# EAGLE design sonar_hotfix_2 (EAGLE 9.0.0)
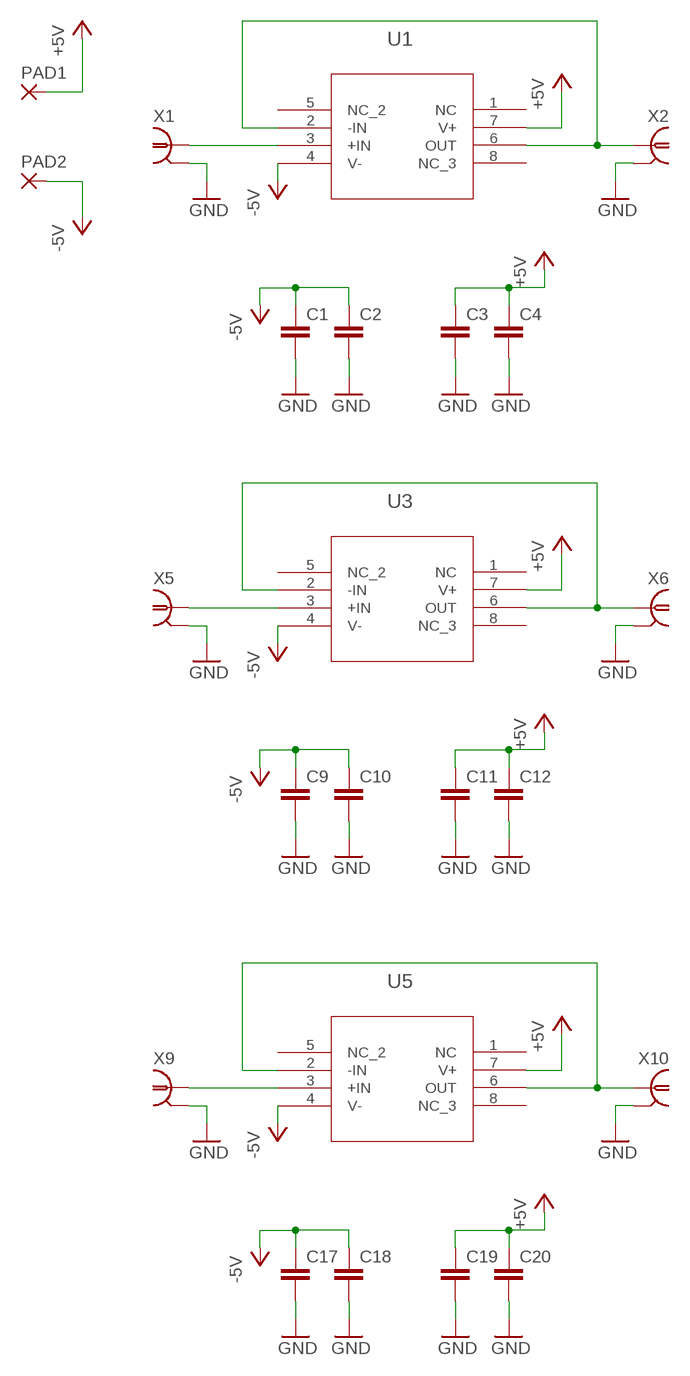
[diagram p0: schematic, sheet 1]

## Parts
C1  C-EUC0603  [C0603]
C2  C-EUC0603  [C0603]
C3  C-EUC0603  [C0603]
C4  C-EUC0603  [C0603]
C9  C-EUC0603  [C0603]
C10  C-EUC0603  [C0603]
C11  C-EUC0603  [C0603]
C12  C-EUC0603  [C0603]
C17  C-EUC0603  [C0603]
C18  C-EUC0603  [C0603]
C19  C-EUC0603  [C0603]
C20  C-EUC0603  [C0603]
PAD1  WIREPADSMD5-2,5  [5-2,5]
PAD2  WIREPADSMD5-2,5  [5-2,5]
U1  LTC6240SO-8  [SO-8]
U3  LTC6240SO-8  [SO-8]
U5  LTC6240SO-8  [SO-8]
X1  0731000105  [0731000105]
X2  0731000105  [0731000105]
X5  0731000105  [0731000105]
X6  0731000105  [0731000105]
X9  0731000105  [0731000105]
X10  0731000105  [0731000105]

## Nets
+5V: C3.1 C4.1 C11.1 C12.1 C19.1 C20.1 PAD1.1(P) U1.7(V+) U3.7(V+) U5.7(V+)
-5V: C1.1 C2.1 C9.1 C10.1 C17.1 C18.1 PAD2.1(P) U1.4(V-) U3.4(V-) U5.4(V-)
GND: C1.2 C2.2 C3.2 C4.2 C9.2 C10.2 C11.2 C12.2 C17.2 C18.2 C19.2 C20.2 X1.P$1 X1.P$2 X2.P$1 X2.P$2 X5.P$1 X5.P$2 X6.P$1 X6.P$2 X9.P$1 X9.P$2 X10.P$1 X10.P$2
N$1: U1.3(+IN) X1.P$3
N$2: U1.2(-IN) U1.6(OUT) X2.P$3
N$5: U3.3(+IN) X5.P$3
N$6: U3.2(-IN) U3.6(OUT) X6.P$3
N$9: U5.3(+IN) X9.P$3
N$10: U5.2(-IN) U5.6(OUT) X10.P$3
Unconnected: U1.1(NC) U1.5(NC_2) U1.8(NC_3) U3.1(NC) U3.5(NC_2) U3.8(NC_3) U5.1(NC) U5.5(NC_2) U5.8(NC_3)

## Library data of the parts
C1-C4 C9-C12 C17-C20 = rcl:C-EU: CAPACITOR, European symbol; SPICEPREFIX: C
PAD1 PAD2 = wirepad:WIREPAD: Wire PAD connect wire on PCB
U1 U3 U5 = hotfix:LTC6240
X1 X2 X5 X6 X9 X10 = hotfix:0731000105

## Board
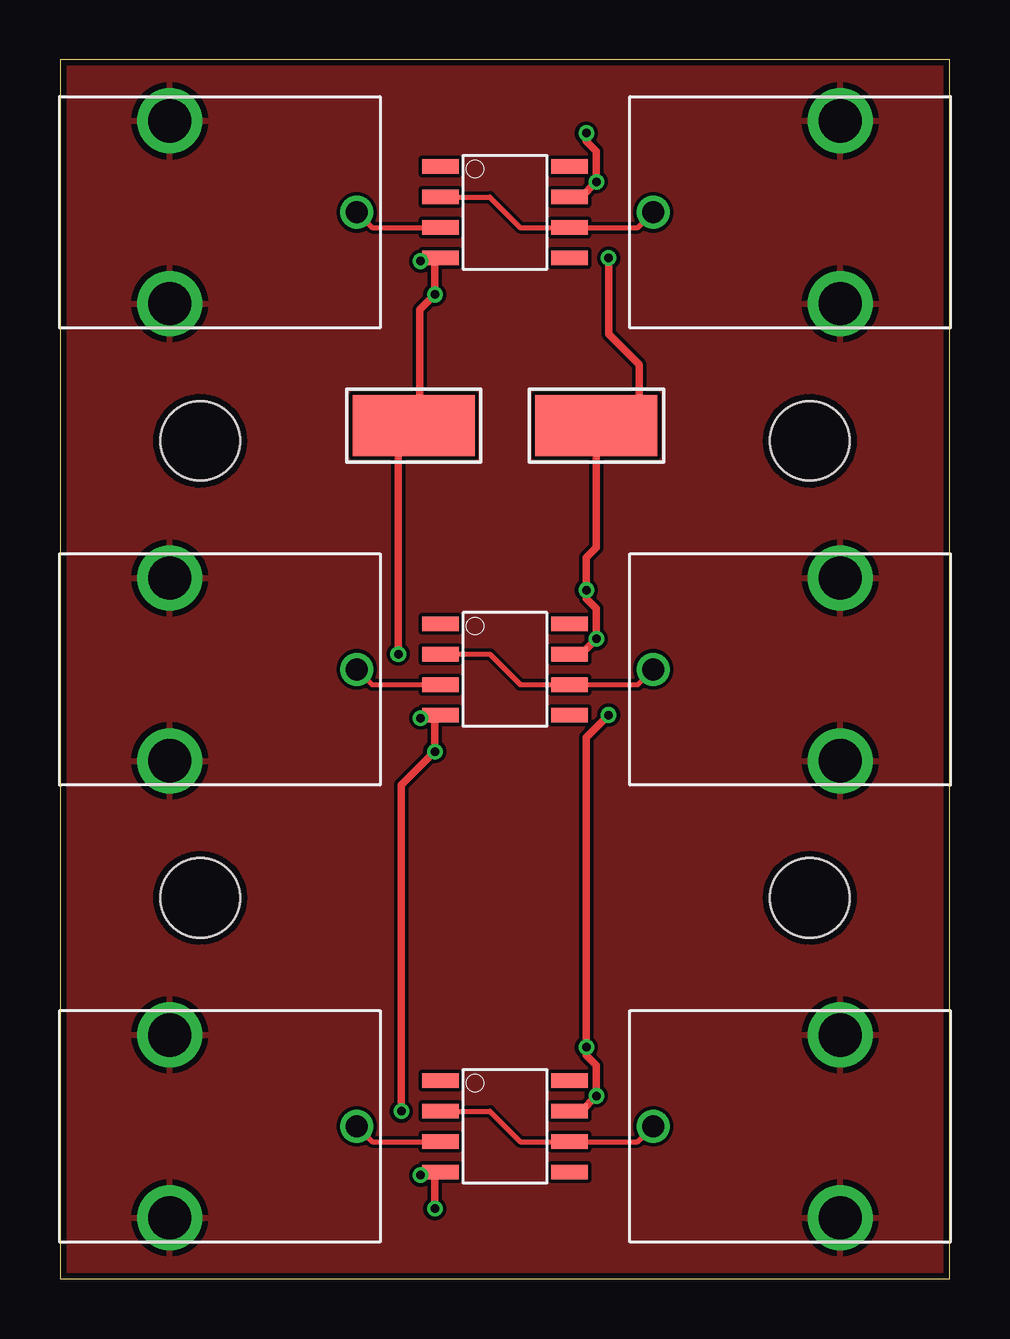
[diagram p1: board, top side]
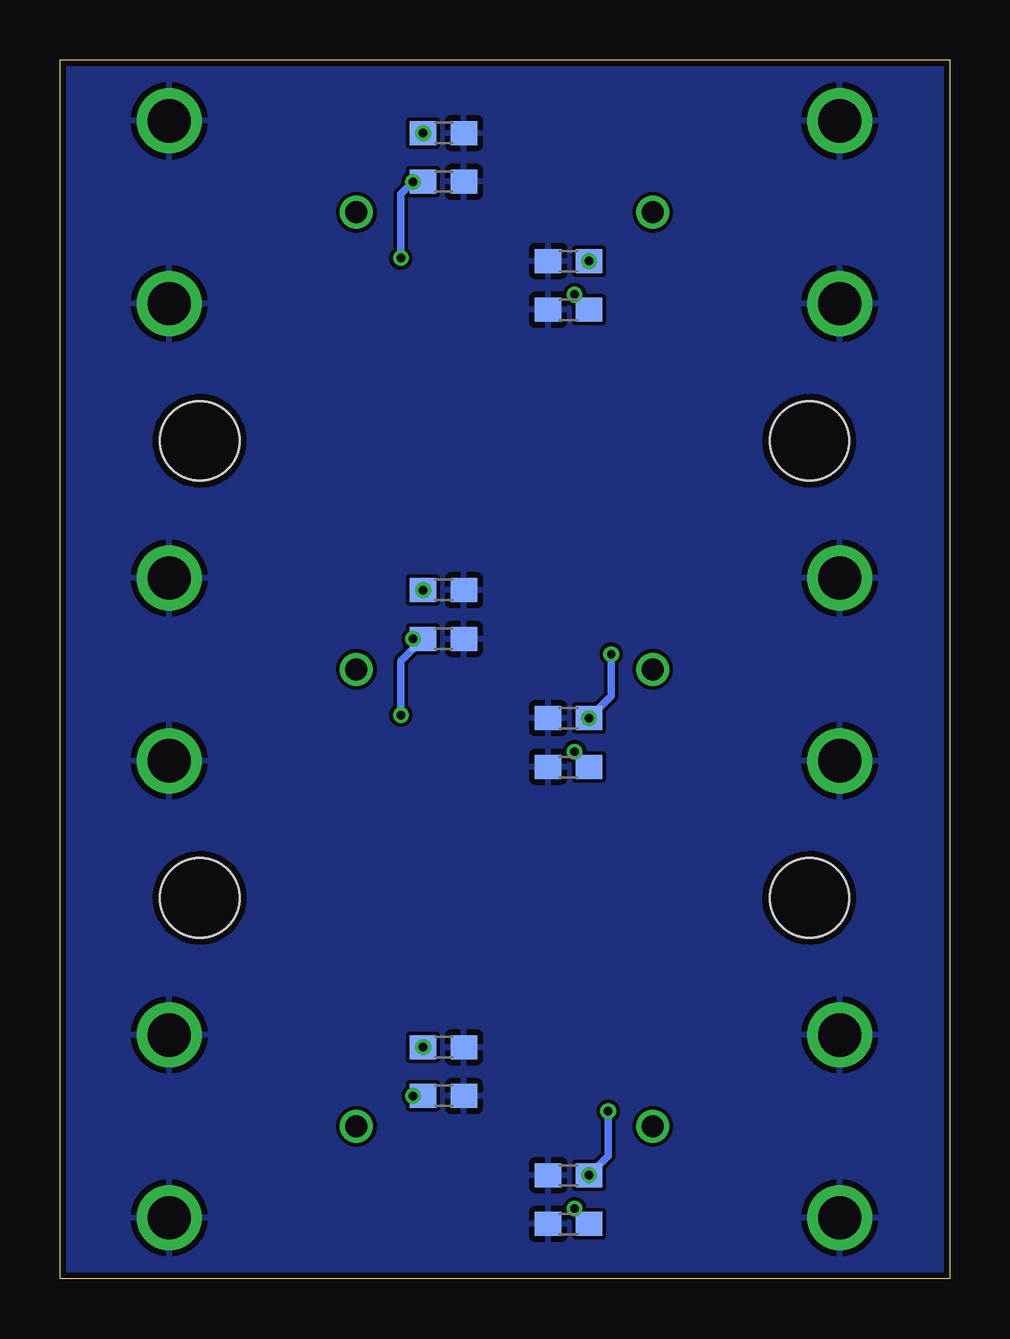
[diagram p2: board, bottom side, seen from below]

Size 37.06 x 50.8 mm. Coordinates in mm from the lower left corner, seen from the top.
Outline: 37.06,50.8 0,50.8 0,0 37.06,0 37.06,50.8
Copper layers (1*16): Top 0.035mm / dielectric 1.5mm / Bottom 0.035mm
Design rules "JLCPCB2Layer": minimum track width 6mil, minimum drill 10mil, track to track 6mil, track to pad 6mil, pad to pad 6mil, via to via 6mil, smd to smd 0mil, copper to edge 10mil, drill to drill 10mil, minimum pad ring 6mil, minimum via ring 6mil, stop-mask expansion 2mil, vias tented up to drill 100mil, thermal gap 10mil

### Footprints (pad centres in the part's own frame; a part is rotated, then mirrored left to right if it is on the bottom)
C0603 = smd 1.1 x 1: 1 -0.85,0; 2 0.85,0
5-2,5 = smd 2.54 x 5.08: 1 0,0
SO-8 = smd 1.524 x 0.61: 1 -2.692,1.905; 2 -2.692,0.635; 3 -2.692,-0.635; 4 -2.692,-1.905; 5 2.692,-1.905; 6 2.692,-0.635; 7 2.692,0.635; 8 2.692,1.905
STAND-OFF = hole 3.302: 0,0
0731000105 = drill 1.803: P$1 3.81,0; P$2 -3.81,0 | drill 0.914: P$3 0,7.798

### Placement (x,y rotation side)
C1  15.88,40.39 180 bottom
C2  15.88,42.42 180 bottom
C3  21.08,45.72 0 bottom
C4  21.08,47.75 0 bottom
C9  15.88,21.34 180 bottom
C10  15.88,23.37 180 bottom
C11  21.08,26.67 0 bottom
C12  21.08,28.7 0 bottom
C17  15.88,2.29 180 bottom
C18  15.88,4.32 180 bottom
C19  21.08,7.62 0 bottom
C20  21.08,9.65 0 bottom
PAD1  22.35,35.56 270 top
PAD2  14.73,35.56 90 top
U1  18.54,44.45 0 top
U3  18.54,25.4 0 top
U5  18.54,6.35 0 top
U$1  [STAND-OFF]  31.24,34.92 0 top
U$2  [STAND-OFF]  5.84,34.92 0 top
U$3  [STAND-OFF]  5.84,15.88 0 top
U$4  [STAND-OFF]  31.24,15.88 0 top
X1  4.57,44.45 270 top
X2  32.51,44.45 90 top
X5  4.57,25.4 270 top
X6  32.51,25.4 90 top
X9  4.57,6.35 270 top
X10  32.51,6.35 90 top

### Tracks (layer width: path | path; a pad name or v marks a point on that pad's centre or on a via)
+5V  (via drill 0.35)
  Top 0.305: U1.7 21.72,45.09 v22.35,45.72 22.35,46.99 21.93,47.41 C4.1 | U3.7 21.72,26.03 v22.35,26.67 22.35,27.94 21.93,28.36 C12.1 21.93,30.06 22.35,30.48 PAD1.1 24.13,36.32 24.13,38.1 22.86,39.37 v22.86,42.55 | U5.7 21.72,6.98 v22.35,7.62 22.35,8.89 21.93,9.31 C20.1 21.93,22.57 v22.86,23.49
  Bottom 0.305: C3.1 v22.35,45.72 22.86,45.21 v22.86,42.55 | v22.35,26.67 C11.1 22.86,25.74 v22.86,23.49 | C19.1 v22.35,7.62
  other vias: 21.93,47.75 21.93,28.7 21.93,9.65
-5V  (via drill 0.35)
  Top 0.305: C2.1 15.72,42.42 U1.4 15.62,42.32 v15.62,41.02 14.99,40.39 14.99,35.69 PAD2.1 14.1,34.92 v14.1,26.03 | C10.1 15.72,23.37 U3.4 15.62,23.27 v15.62,21.97 14.22,20.57 v14.22,6.98 | v15.62,2.92 15.62,4.22 U5.4 15.72,4.32 C18.1
  Bottom 0.305: v15.62,41.02 15.62,40.98 C1.1 | v15.62,21.97 15.62,21.93 C9.1 | v15.62,2.92 15.62,2.88 C17.1 | v14.1,26.03 14.1,24.3 C10.1 | v14.22,6.98 14.22,5.12 C18.1
  other vias: 15.03,42.42 15.03,23.37 15.03,4.32
GND
  pour Top: 0,50.8 37.08,50.8 37.08,0 0,0
  pour Bottom: 0,50.8 37.08,50.8 37.08,0 0,0
N$1
  Top 0.203: X1.P$3 13.01,43.81 U1.3
N$2
  Top 0.203: U1.2 17.91,45.09 19.18,43.81 U1.6 24.08,43.81 X2.P$3
N$5
  Top 0.203: X5.P$3 13.01,24.77 U3.3
N$6
  Top 0.203: U3.2 17.91,26.03 19.18,24.77 U3.6 24.08,24.77 X6.P$3
N$9
  Top 0.203: X9.P$3 13.01,5.71 U5.3
N$10
  Top 0.203: U5.2 17.91,6.98 19.18,5.71 U5.6 24.08,5.71 X10.P$3